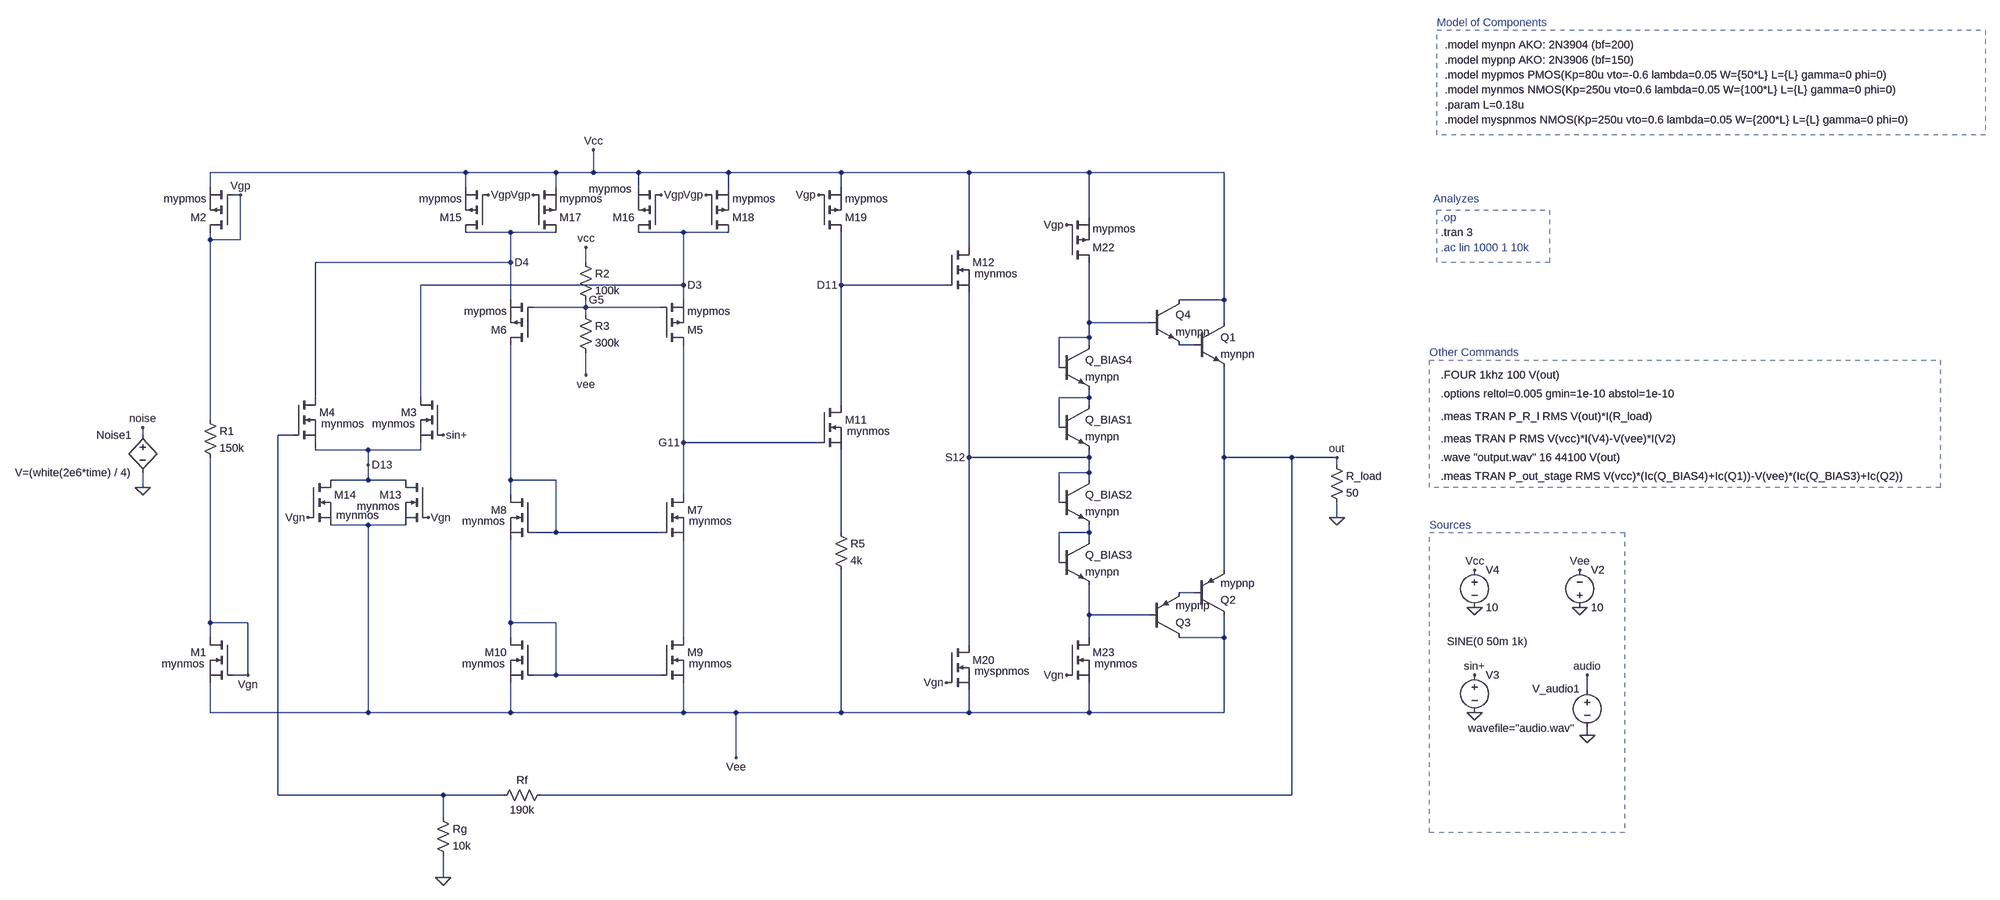
[diagram p0: schematic phase2_closed_loop_amplifier.asc]
phase2_closed_loop_amplifier.asc, the LTspice schematic file:
Version 4.1
SHEET 1 3592 1236
WIRE -192 -304 -736 -304
WIRE 0 -304 -192 -304
WIRE 80 -304 80 -352
WIRE 80 -304 0 -304
WIRE 176 -304 80 -304
WIRE 368 -304 176 -304
WIRE 608 -304 368 -304
WIRE 880 -304 608 -304
WIRE 1136 -304 880 -304
WIRE 1424 -304 1136 -304
WIRE -736 -272 -736 -304
WIRE -192 -272 -192 -304
WIRE 0 -272 0 -304
WIRE 176 -272 176 -304
WIRE 368 -272 368 -304
WIRE 608 -272 608 -304
WIRE -672 -256 -688 -256
WIRE 1136 -208 1136 -304
WIRE -96 -176 -192 -176
WIRE 0 -176 -96 -176
WIRE 272 -176 176 -176
WIRE 368 -176 272 -176
WIRE -736 -160 -736 -176
WIRE -672 -160 -672 -256
WIRE -672 -160 -736 -160
WIRE 880 -144 880 -304
WIRE -96 -112 -96 -176
WIRE -96 -112 -512 -112
WIRE 64 -112 64 -144
WIRE 272 -64 272 -176
WIRE 272 -64 -288 -64
WIRE 608 -64 608 -176
WIRE 832 -64 608 -64
WIRE -96 -32 -96 -112
WIRE 272 -32 272 -64
WIRE 1424 -32 1424 -304
WIRE 1424 -32 1328 -32
WIRE 64 -16 64 -32
WIRE 64 -16 -48 -16
WIRE 224 -16 64 -16
WIRE 64 0 64 -16
WIRE 1136 16 1136 -112
WIRE 1264 16 1136 16
WIRE 1424 16 1424 -32
WIRE 1136 48 1136 16
WIRE 1136 48 1072 48
WIRE 1136 64 1136 48
WIRE 1360 64 1328 64
WIRE 1072 112 1072 48
WIRE 64 128 64 80
WIRE -512 176 -512 -112
WIRE -288 176 -288 -64
WIRE 1136 176 1136 160
WIRE 1136 176 1072 176
WIRE 608 192 608 -64
WIRE 1136 192 1136 176
WIRE -736 224 -736 -160
WIRE 1072 240 1072 176
WIRE -880 256 -880 240
WIRE -560 256 -592 256
WIRE 272 272 272 64
WIRE 560 272 272 272
WIRE -512 288 -512 272
WIRE -400 288 -512 288
WIRE -288 288 -288 272
WIRE -288 288 -400 288
WIRE 880 304 880 -48
WIRE 1136 304 1136 288
WIRE 1136 304 880 304
WIRE 1424 304 1424 112
WIRE 1568 304 1424 304
WIRE 1664 304 1568 304
WIRE -400 320 -400 288
WIRE 1664 320 1664 304
WIRE 1136 336 1136 304
WIRE 1136 336 1072 336
WIRE -400 352 -400 320
WIRE -400 352 -480 352
WIRE -320 352 -400 352
WIRE -96 352 -96 64
WIRE 0 352 -96 352
WIRE 1136 352 1136 336
WIRE -880 368 -880 336
WIRE -96 384 -96 352
WIRE 272 384 272 272
WIRE 1072 400 1072 336
WIRE 1664 432 1664 400
WIRE -400 448 -480 448
WIRE -320 448 -400 448
WIRE 0 464 0 352
WIRE 0 464 -48 464
WIRE 224 464 0 464
WIRE 608 464 608 288
WIRE 1136 464 1136 448
WIRE 1136 464 1072 464
WIRE 1136 480 1136 464
WIRE 1072 528 1072 464
WIRE 1424 544 1424 304
WIRE 1360 592 1328 592
WIRE 1136 640 1136 576
WIRE 1264 640 1136 640
WIRE -736 656 -736 304
WIRE -656 656 -736 656
WIRE -96 656 -96 480
WIRE 0 656 -96 656
WIRE -736 688 -736 656
WIRE -96 688 -96 656
WIRE 272 688 272 480
WIRE 1136 688 1136 640
WIRE 1424 688 1424 640
WIRE 1424 688 1328 688
WIRE 880 704 880 304
WIRE -656 768 -656 656
WIRE -656 768 -688 768
WIRE 0 768 0 656
WIRE 0 768 -48 768
WIRE 224 768 0 768
WIRE 2224 800 2224 768
WIRE -736 848 -736 784
WIRE -400 848 -400 448
WIRE -400 848 -736 848
WIRE -96 848 -96 784
WIRE -96 848 -400 848
WIRE 272 848 272 784
WIRE 272 848 -96 848
WIRE 384 848 272 848
WIRE 608 848 608 544
WIRE 608 848 384 848
WIRE 880 848 880 800
WIRE 880 848 608 848
WIRE 1136 848 1136 784
WIRE 1136 848 880 848
WIRE 1424 848 1424 688
WIRE 1424 848 1136 848
WIRE 2224 896 2224 880
WIRE 384 944 384 848
WIRE -592 1024 -592 256
WIRE -240 1024 -592 1024
WIRE -112 1024 -240 1024
WIRE 1568 1024 1568 304
WIRE 1568 1024 -32 1024
WIRE -240 1072 -240 1024
WIRE -240 1200 -240 1152
FLAG -672 -256 Vgp
FLAG 320 -256 Vgp
FLAG -656 768 Vgn
FLAG -272 432 Vgn
FLAG -528 432 Vgn
FLAG -144 -256 Vgp
FLAG -48 -256 Vgp
FLAG 224 -256 Vgp
FLAG 560 -256 Vgp
FLAG 832 784 Vgn
FLAG 1984 848 0
FLAG 1984 768 sin+
FLAG -96 -112 D4
FLAG 272 -64 D3
FLAG 272 272 G11
FLAG 608 -64 D11
FLAG 64 -16 G5
FLAG -400 320 D13
FLAG 1664 432 0
FLAG 1664 304 out
FLAG -240 1200 0
FLAG 1088 -192 Vgp
FLAG 1088 768 Vgn
FLAG -880 368 0
FLAG -880 240 noise
FLAG 2208 624 0
FLAG 384 944 Vee
FLAG 1984 624 0
FLAG 1984 544 Vcc
FLAG 2208 544 Vee
FLAG 80 -352 Vcc
FLAG 64 -144 vcc
FLAG 64 128 vee
FLAG 2224 896 0
FLAG 2224 768 audio
FLAG 880 304 S12
FLAG -240 256 sin+
SYMBOL nmos -688 688 M0
WINDOW 3 60 56 Left 2
SYMATTR Value mynmos
SYMATTR InstName M1
SYMBOL pmos -688 -176 R180
SYMATTR InstName M2
SYMATTR Value mypmos
SYMBOL res -752 208 R0
SYMATTR InstName R1
SYMATTR Value 150k
SYMBOL voltage 1984 752 R0
WINDOW 3 -59 -56 Left 2
WINDOW 123 0 0 Left 0
WINDOW 39 0 0 Left 0
SYMATTR Value SINE(0 50m 1k)
SYMATTR InstName V3
SYMBOL res 48 -128 R0
SYMATTR InstName R2
SYMATTR Value 100k
SYMBOL res 48 -16 R0
SYMATTR InstName R3
SYMATTR Value 300k
SYMBOL res 592 448 R0
SYMATTR InstName R5
SYMATTR Value 4k
SYMBOL nmos -240 176 M0
WINDOW 3 60 56 Left 2
SYMATTR Value mynmos
SYMATTR InstName M3
SYMBOL nmos -560 176 R0
WINDOW 3 60 56 Left 2
SYMATTR Value mynmos
SYMATTR InstName M4
SYMBOL pmos 224 64 M180
SYMATTR InstName M5
SYMATTR Value mypmos
SYMBOL pmos -48 64 R180
SYMATTR InstName M6
SYMATTR Value mypmos
SYMBOL nmos 224 384 R0
WINDOW 3 60 56 Left 2
SYMATTR Value mynmos
SYMATTR InstName M7
SYMBOL nmos -48 384 M0
WINDOW 3 60 56 Left 2
SYMATTR Value mynmos
SYMATTR InstName M8
SYMBOL nmos 224 688 R0
WINDOW 3 60 56 Left 2
SYMATTR Value mynmos
SYMATTR InstName M9
SYMBOL nmos -48 688 M0
WINDOW 3 60 56 Left 2
SYMATTR Value mynmos
SYMATTR InstName M10
SYMBOL nmos 560 192 R0
WINDOW 3 60 56 Left 2
SYMATTR Value mynmos
SYMATTR InstName M11
SYMBOL nmos 832 -144 R0
WINDOW 3 60 56 Left 2
SYMATTR Value mynmos
SYMATTR InstName M12
SYMBOL nmos -272 352 M0
WINDOW 3 60 56 Left 2
SYMATTR Value mynmos
SYMATTR InstName M13
SYMBOL nmos -528 352 R0
WINDOW 3 60 75 Left 2
SYMATTR Value mynmos
SYMATTR InstName M14
SYMBOL pmos -144 -176 R180
SYMATTR InstName M15
SYMATTR Value mypmos
SYMBOL pmos 224 -176 R180
WINDOW 3 62 93 Left 2
SYMATTR Value mypmos
SYMATTR InstName M16
SYMBOL pmos -48 -176 M180
SYMATTR InstName M17
SYMATTR Value mypmos
SYMBOL pmos 320 -176 M180
SYMATTR InstName M18
SYMATTR Value mypmos
SYMBOL pmos 560 -176 M180
SYMATTR InstName M19
SYMATTR Value mypmos
SYMBOL nmos 832 704 R0
WINDOW 3 60 56 Left 2
SYMATTR Value myspnmos
SYMATTR InstName M20
SYMBOL npn 1360 16 R0
SYMATTR InstName Q1
SYMATTR Value mynpn
SYMBOL pnp 1360 640 M180
SYMATTR InstName Q2
SYMATTR Value mypnp
SYMBOL npn 1072 192 R0
SYMATTR InstName Q_BIAS1
SYMATTR Value mynpn
SYMBOL npn 1072 352 R0
SYMATTR InstName Q_BIAS2
SYMATTR Value mynpn
SYMBOL res 1648 304 R0
SYMATTR InstName R_load
SYMATTR Value 50
SYMBOL res -256 1056 R0
SYMATTR InstName Rg
SYMATTR Value 10k
SYMBOL res -16 1008 R90
WINDOW 0 0 56 VBottom 2
WINDOW 3 32 56 VTop 2
SYMATTR InstName Rf
SYMATTR Value 190k
SYMBOL pmos 1088 -112 M180
SYMATTR InstName M22
SYMATTR Value mypmos
SYMBOL npn 1072 480 R0
SYMATTR InstName Q_BIAS3
SYMATTR Value mynpn
SYMBOL pnp 1264 688 M180
SYMATTR InstName Q3
SYMATTR Value mypnp
SYMBOL nmos 1088 688 R0
WINDOW 3 60 56 Left 2
SYMATTR Value mynmos
SYMATTR InstName M23
SYMBOL npn 1072 64 R0
SYMATTR InstName Q_BIAS4
SYMATTR Value mynpn
SYMBOL npn 1264 -32 R0
SYMATTR InstName Q4
SYMATTR Value mynpn
SYMBOL bv -880 240 M0
SYMATTR InstName Noise1
SYMATTR Value V=(white(2e6*time) / 4)
SYMBOL voltage 2208 640 M180
WINDOW 0 24 96 Left 2
WINDOW 3 24 16 Left 2
WINDOW 123 0 0 Left 0
WINDOW 39 0 0 Left 0
SYMATTR InstName V2
SYMATTR Value 10
SYMBOL voltage 1984 528 R0
WINDOW 123 0 0 Left 0
WINDOW 39 0 0 Left 0
SYMATTR InstName V4
SYMATTR Value 10
SYMBOL voltage 2224 784 R0
WINDOW 123 -254 97 Left 2
WINDOW 39 0 0 Left 0
WINDOW 3 -203 98 Left 2
WINDOW 0 -117 13 Left 2
SYMATTR Value2 wavefile="audio.wav"
SYMATTR Value ""
SYMATTR InstName V_audio1
TEXT 1920 -448 Left 2 !.param L=0.18u
TEXT 1920 -480 Left 2 !.model mynmos NMOS(Kp=250u vto=0.6 lambda=0.05 W={100*L} L={L} gamma=0 phi=0)
TEXT 1920 -512 Left 2 !.model mypmos PMOS(Kp=80u vto=-0.6 lambda=0.05 W={50*L} L={L} gamma=0 phi=0)
TEXT 1920 -416 Left 2 !.model myspnmos NMOS(Kp=250u vto=0.6 lambda=0.05 W={200*L} L={L} gamma=0 phi=0)
TEXT 1912 -208 Left 2 ;.op
TEXT 1920 -544 Left 2 !.model mypnp AKO: 2N3906 (bf=150)
TEXT 1920 -576 Left 2 !.model mynpn AKO: 2N3904 (bf=200)
TEXT 1912 -176 Left 2 !.tran 3
TEXT 1912 168 Left 2 !.options reltol=0.005 gmin=1e-10 abstol=1e-10
TEXT 1912 216 Left 2 !.meas TRAN P_R_l RMS V(out)*I(R_load)
TEXT 1912 264 Left 2 !.meas TRAN P RMS V(vcc)*I(V4)-V(vee)*I(V2)
TEXT 1912 128 Left 2 !.FOUR 1khz 100 V(out)
TEXT 1912 -144 Left 2 ;.ac lin 1000 1 10k
TEXT 1888 448 Left 2 ;Sources
TEXT 1904 -624 Left 2 ;Model of Components
TEXT 1896 -248 Left 2 ;Analyzes
TEXT 1888 80 Left 2 ;Other Commands
TEXT 1912 304 Left 2 !.wave "output.wav" 16 44100 V(out)
TEXT 1912 344 Left 2 !.meas TRAN P_out_stage RMS V(vcc)*(Ic(Q_BIAS4)+Ic(Q1))-V(vee)*(Ic(Q_BIAS3)+Ic(Q2))
RECTANGLE Normal 3072 -384 1904 -608 2
RECTANGLE Normal 2144 -112 1904 -224 2
RECTANGLE Normal 2304 1104 1888 464 2
RECTANGLE Normal 2976 368 1888 96 2

The netlist it stands for:
* phase2_closed_loop_amplifier.asc
M1 Vgn Vgn Vee Vee mynmos
M2 Vgp Vgp Vcc Vcc mypmos
R1 Vgp Vgn 150k
V3 sin+ 0 SINE(0 50m 1k)
R2 Vcc G5 100k
R3 G5 Vee 300k
R5 N006 Vee 4k
M3 D3 sin+ D13 D13 mynmos
M4 D4 N004 D13 D13 mynmos
M5 G11 G5 D3 D3 mypmos
M6 N005 G5 D4 D4 mypmos
M7 G11 N005 N011 N011 mynmos
M8 N005 N005 N010 N010 mynmos
M9 N011 N010 Vee Vee mynmos
M10 N010 N010 Vee Vee mynmos
M11 D11 G11 N006 N006 mynmos
M12 Vcc D11 S12 S12 mynmos
M13 D13 Vgn Vee Vee mynmos
M14 D13 Vgn Vee Vee mynmos
M15 D4 Vgp Vcc Vcc mypmos
M16 D3 Vgp Vcc Vcc mypmos
M17 D4 Vgp Vcc Vcc mypmos
M18 D3 Vgp Vcc Vcc mypmos
M19 D11 Vgp Vcc Vcc mypmos
M20 S12 Vgn Vee Vee myspnmos
Q1 Vcc N002 out 0 mynpn
Q2 Vee N008 out 0 mypnp
Q_BIAS1 N003 N003 S12 0 mynpn
Q_BIAS2 S12 S12 N007 0 mynpn
R_load out 0 50
Rg N004 0 10k
Rf out N004 190k
M22 N001 Vgp Vcc Vcc mypmos
Q_BIAS3 N007 N007 N009 0 mynpn
Q3 Vee N009 N008 0 mypnp
M23 N009 Vgn Vee Vee mynmos
Q_BIAS4 N001 N001 N003 0 mynpn
Q4 Vcc N001 N002 0 mynpn
B§Noise1 noise 0 V=(white(2e6*time) / 4)
V2 0 Vee 10
V4 Vcc 0 10
V_audio1 audio 0 wavefile="audio.wav"
.model NPN NPN
.model PNP PNP
.lib standard.bjt
.model NMOS NMOS
.model PMOS PMOS
.lib standard.mos
.param L=0.18u
.model mynmos NMOS(Kp=250u vto=0.6 lambda=0.05 W={100*L} L={L} gamma=0 phi=0)
.model mypmos PMOS(Kp=80u vto=-0.6 lambda=0.05 W={50*L} L={L} gamma=0 phi=0)
.model myspnmos NMOS(Kp=250u vto=0.6 lambda=0.05 W={200*L} L={L} gamma=0 phi=0)
* .op
.model mypnp AKO: 2N3906 (bf=150)
.model mynpn AKO: 2N3904 (bf=200)
.tran 3
.options reltol=0.005 gmin=1e-10 abstol=1e-10
.meas TRAN P_R_l RMS V(out)*I(R_load)
.meas TRAN P RMS V(vcc)*I(V4)-V(vee)*I(V2)
.FOUR 1khz 100 V(out)
* .ac lin 1000 1 10k
* Sources
* Model of Components
* Analyzes
* Other Commands
.wave "output.wav" 16 44100 V(out)
.meas TRAN P_out_stage RMS V(vcc)*(Ic(Q_BIAS4)+Ic(Q1))-V(vee)*(Ic(Q_BIAS3)+Ic(Q2))
.backanno
.end